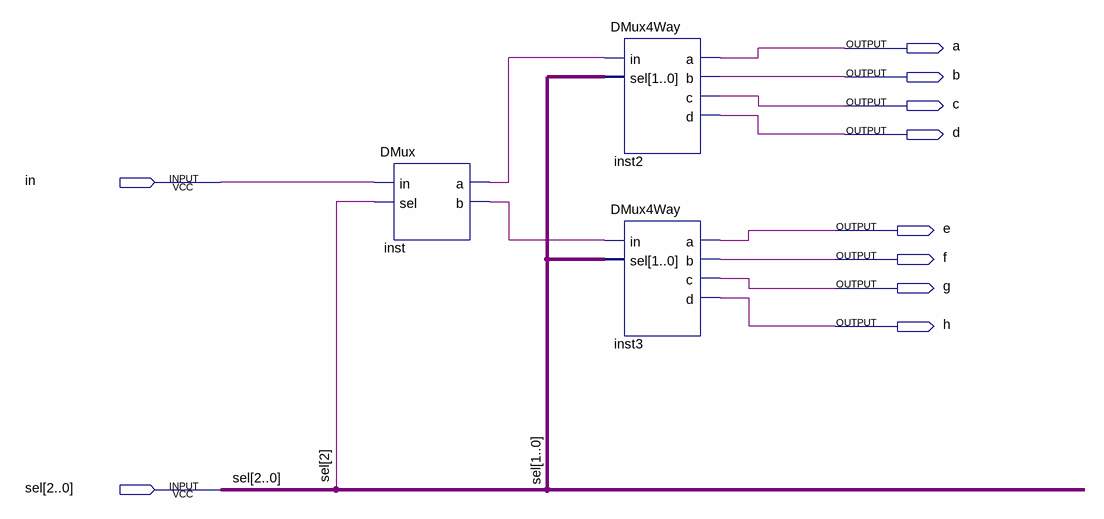
[diagram p0: schematic sheet]
// Quartus schematic DMux8Way.bdf as structural Verilog: 3 symbols, 10 pins
module DMux8Way (
  input  in,
  input  [2:0] sel,
  output a,
  output b,
  output c,
  output d,
  output e,
  output f,
  output g,
  output h
);

  wire inst_a, inst_b;

  DMux inst (.in(in), .sel(sel[2]), .a(inst_a), .b(inst_b));
  DMux4Way inst2 (.in(inst_a), .sel(sel[1:0]), .a(a), .b(b), .c(c), .d(d));
  DMux4Way inst3 (.in(inst_b), .sel(sel[1:0]), .a(e), .b(f), .c(g), .d(h));
endmodule
